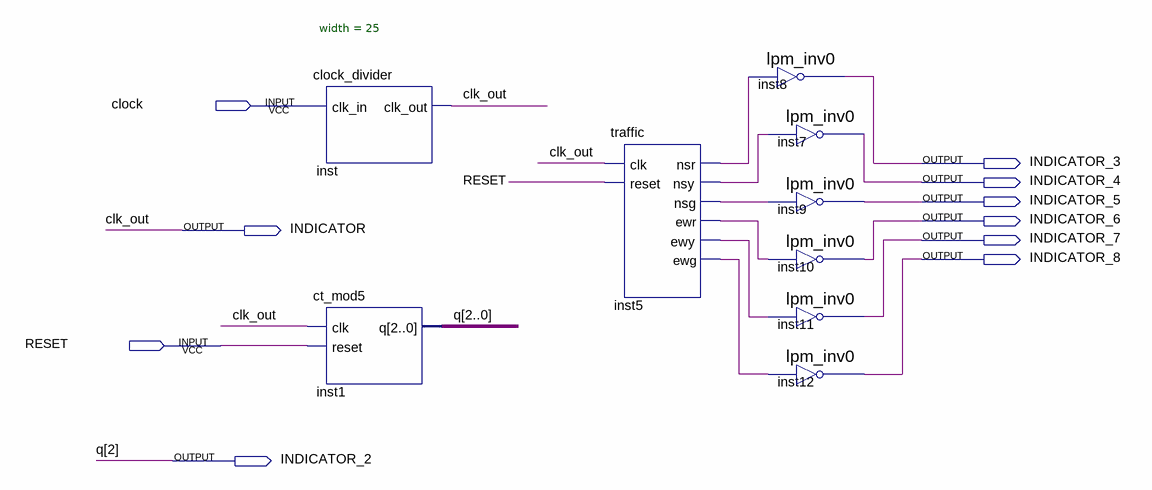
[diagram p0: schematic sheet]
// Quartus schematic traffic_light_01.bdf as structural Verilog: 9 symbols, 10 pins
module traffic_light_01 (
  input  clock,
  input  RESET,
  output INDICATOR_3,
  output INDICATOR_4,
  output INDICATOR_5,
  output INDICATOR_6,
  output INDICATOR,
  output INDICATOR_7,
  output INDICATOR_8,
  output INDICATOR_2
);

  wire inst5_ewg, inst5_ewr, inst5_ewy, inst5_nsg, inst5_nsr, inst5_nsy;
  wire [1:0] q;

  clock_divider #(.width(25)) inst (.clk_in(clock), .clk_out(INDICATOR));
  ct_mod5 inst1 (.clk(INDICATOR), .reset(RESET), .q({INDICATOR_2, q}));
  traffic inst5 (
    .clk(INDICATOR), .reset(RESET), .nsr(inst5_nsr), .nsy(inst5_nsy), .nsg(inst5_nsg), .ewr(inst5_ewr),
    .ewy(inst5_ewy), .ewg(inst5_ewg));
  lpm_inv0 inst8 (.data(inst5_nsr), .result(INDICATOR_3));
  lpm_inv0 inst7 (.data(inst5_nsy), .result(INDICATOR_4));
  lpm_inv0 inst9 (.data(inst5_nsg), .result(INDICATOR_5));
  lpm_inv0 inst10 (.data(inst5_ewr), .result(INDICATOR_6));
  lpm_inv0 inst11 (.data(inst5_ewy), .result(INDICATOR_7));
  lpm_inv0 inst12 (.data(inst5_ewg), .result(INDICATOR_8));

  // Other names for the same wires on the sheet: clk_out = INDICATOR; q[2] = INDICATOR_2
endmodule
